# Altium schematic sheet Voltage Regulators.SchDoc: Voltage Regulators
size A4; Date: Dec. 27th, 2022; Author: Karl Asseily; DrawnBy: Karl Asseily; DocumentNumber: 202301140903; Revision: 1.2; SheetNumber: 8; SheetTotal: 20
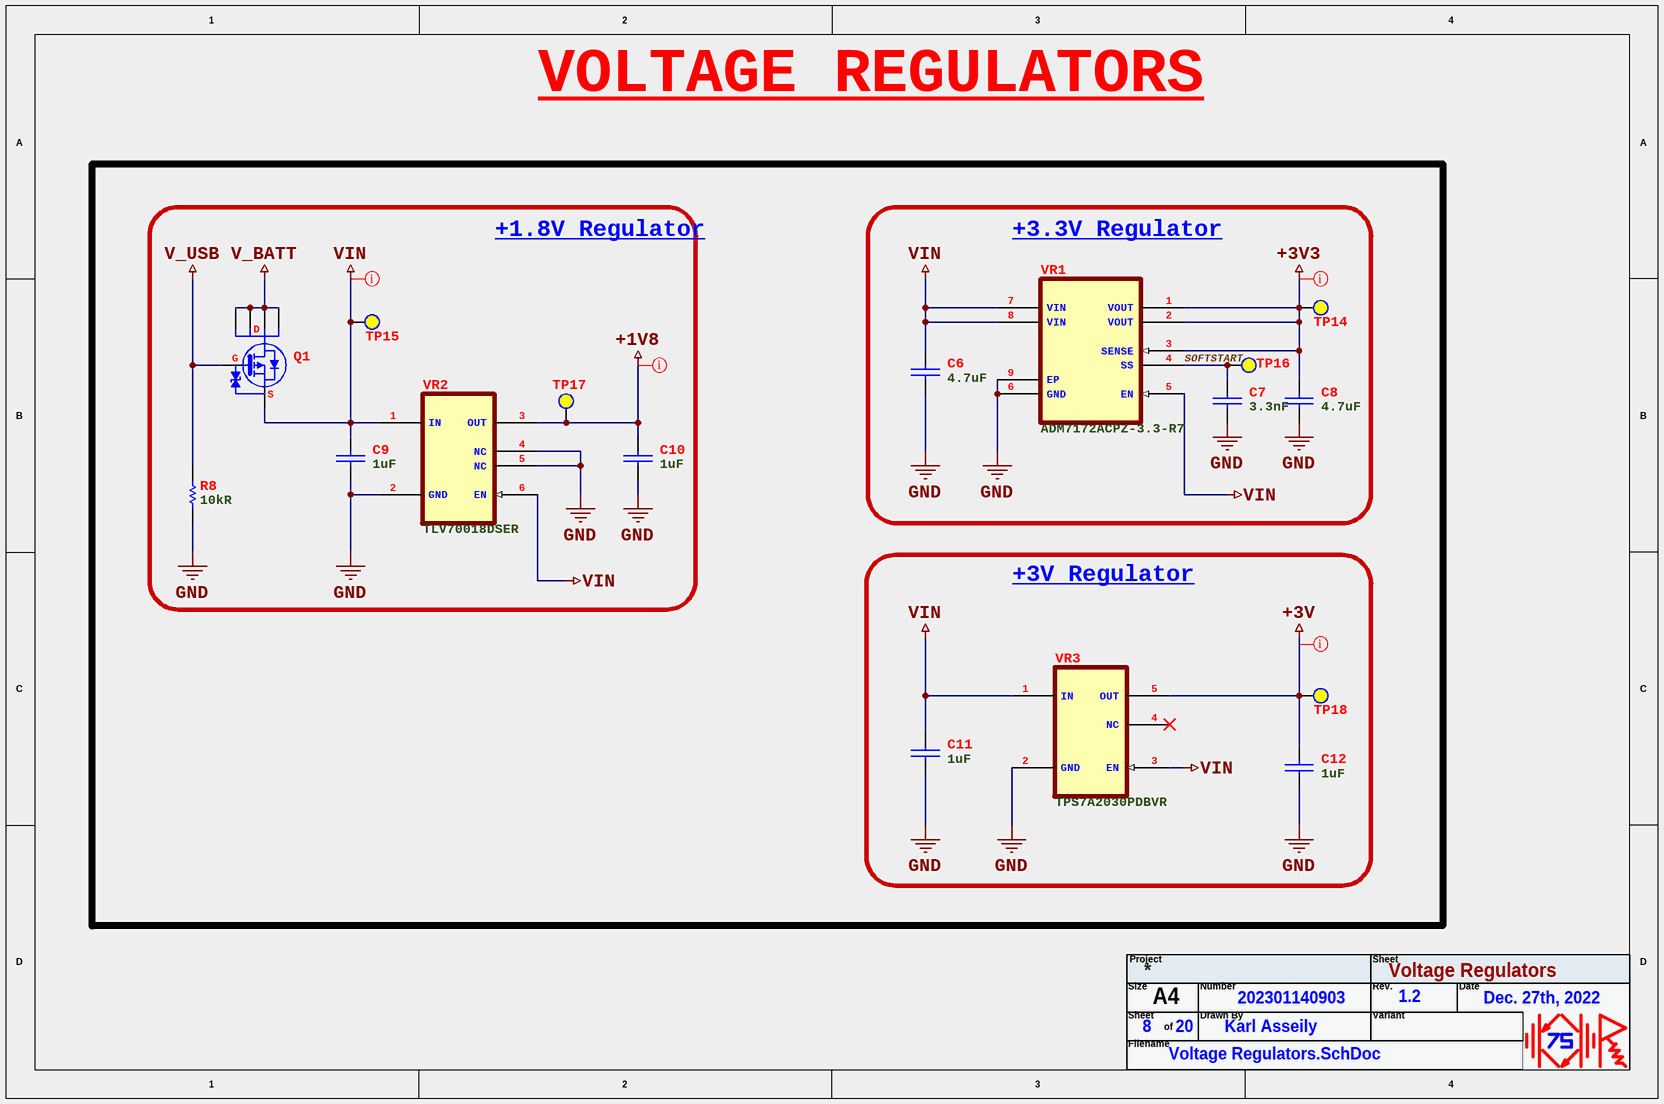
[diagram p0: Voltage Regulators.SchDoc]

## Parts
C6  4.7uF  [CAP_0805]
C7  3.3nF  [CAP_0603]
C8  4.7uF  [CAP_0805]
C9  1uF  [CAP_0805]
C10  1uF  [CAP_0805]
C11  1uF  [CAP_0805]
C12  1uF  [CAP_0805]
Q1  SSM6J412TU,LF  [MOS_SOTFL65P210X75-6N]  (value not drawn)
R8  10kR  [RES_0603]
TP14  +3V3  [TEST POINT PAD]  (value not drawn)  (no BOM)
TP15  VIN  [TEST POINT PAD]  (value not drawn)  (no BOM)
TP16  SOFTSTART  [TEST POINT HOLE]  (value not drawn)  (no BOM)
TP17  +1V8  [TEST POINT PAD]  (value not drawn)  (no BOM)
TP18  +3V  [TEST POINT PAD]  (value not drawn)  (no BOM)
VR1  ADM7172ACPZ-3.3-R7  [REG_SON50P300X300X80-9N]
VR2  TLV70018DSER  [REG_SON50P150X150X80-6N]
VR3  TPS7A2030PDBVR  [REG_SOT95P280X145-5N]

## Blocks framed on the sheet
+1.8V Regulator: C9 C10 Q1 R8 TP15 TP17 VR2
+3.3V Regulator: C6-C8 TP14 TP16 VR1
+3V Regulator: C11 C12 TP18 VR3

## Nets
+1V8: C10.1 TP17.TP VR2.3(OUT)
+3V: C12.1 TP18.TP VR3.5(OUT)
+3V3: C8.1 TP14.TP VR1.1(VOUT) VR1.2(VOUT) VR1.3(SENSE)
GND: C6.2 C7.2 C8.2 C9.2 C10.2 C11.2 C12.2 R8.2 VR1.6(GND) VR1.9(EP) VR2.2(GND) VR2.4(NC) VR2.5(NC) VR3.2(GND)
V_BATT: Q1.1(D) Q1.2(D) Q1.5(D) Q1.6(D)
V_USB: Q1.3(G) R8.1
VIN: C6.1 C9.1 C11.1 Q1.4(S) TP15.TP VR1.5(EN) VR1.7(VIN) VR1.8(VIN) VR2.1(IN) VR2.6(EN) VR3.1(IN) VR3.3(EN)
SOFTSTART: C7.1 TP16.TP VR1.4(SS)

Not connected (* = marked no-connect by the designer): VR3 4(NC)*

## Layout directives
net class POWER; rule Supply Nets [Voltage = 5.000]: VIN
net class POWER; rule Supply Nets [Voltage = 3.300]: +3V3
net class POWER; rule Supply Nets [Voltage = 1.800]: +1V8
net class POWER; rule Supply Nets [Voltage = 3.000]: +3V

## Notes on the sheet
- VOLTAGE REGULATORS
- (near Q1) D
- (near Q1) G
- (near Q1) S
- Project
- Sheet
- Size
- Filename
- A4
- of
- Number
- Drawn By
- Rev.
- Variant
- Date

## Library data of the parts
C6 C8 = CAP_4.7uF-25V-10%_0805: 4.7 µF ±10% 25V Ceramic Capacitor X7R 0805 (2012 Metric); Manufacturer: Yageo; Manufacturer Part Number: CC0805KKX7R8BB475; Supplier 1: Digi-Key; RoHS: Yes; Category: Ceramic Capacitors; Stock 1: 26099; Pricing 1: 1=0.39000, 10=0.27000, 50=0.18940, 100=0.16230, 500=0.12172, 1000=0.10278 (USD); Mounting Technology: Surface Mount; Case/Package: 0805; Case Code (Metric): 2012; Case Code (Imperial): 0805; Weight: 0.000194oz; Min Operating Temperature: -55°C; Max Operating Temperature: 125°C; Packaging: Tape and Reel; Capacitance: 4.7uF; Voltage Rating: 25V; Tolerance: 10%; Dielectric: X7R; Termination: SMD/SMT; Voltage Rating (DC): 25V; Package Quantity: 3000; Length: 0.079inch; Width: 0.049inch; Thickness: 0.057inch; Lead Free: Lead Free; Halogen Free: Halogen Free; RoHS Compliant: Yes; ComponentLink1URL: C:\Users\Public\Documents\Altium\Projects\Cellar_Watchdog\Docs\Capacitor\UPY-GP_NP0_16V-to-50V_18.pdf; ComponentLink1Description: Datasheet; Supplier 2: Mouser; Supplier Part Number 1: 311-1885-1-ND; Supplier Part Number 2: 603-CC805KKX7R8BB475
C7 = CAP_3.3nF-50V-10%_0603: 3300 pF ±10% 50V Ceramic Capacitor X7R 0603 (1608 Metric); Manufacturer: Yageo; Manufacturer Part Number: CC0603KRX7R9BB332; Dissipation Factor: 3%; Insulation Resistance: 100GR; Supplier 1: Digi-Key; RoHS: Yes; Category: Ceramic Capacitors; Stock 1: 541031; Pricing 1: 1=0.10000, 10=0.04600, 50=0.02480, 100=0.02030, 500=0.01450, 1000=0.01139 (USD); Mounting Technology: Surface Mount; Case/Package: 0603; Pins: 2; Case Code (Imperial): 0603; Case Code (Metric): 1608; Dielectric Material: Ceramic; Min Operating Temperature: -55°C; Max Operating Temperature: 125°C; Tolerance: 10%; Capacitance: 3.3nF; Dielectric: X7R; Package Quantity: 1; Voltage Rating: 50V; Voltage Rating (DC): 50V; Packaging: Tape and Reel; Termination: SMD/SMT; Resistor Type: Ceramic; Voltage: 50V; Series: CC; Length: 1.6mm; Width: 0.031inch; Height: 0.8mm; Thickness: 0.035inch; Depth: 0.8mm; Radiation Hardening: No; RoHS Compliant: Yes; Reach SVHC Compliant: Yes; Lead Free: Lead Free; Halogen Free: Halogen Free; ComponentLink1URL: C:\Users\Public\Documents\Altium\Projects\Cellar_Watchdog\Docs\Capacitor\UPY-GPHC_X7R_6.3V-to-250V_22.pdf; ComponentLink1Description: Datasheet; Supplier 2: Mouser; Supplier Part Number 1: 311-1082-1-ND; Supplier Part Number 2: 603-CC603KRX7R9BB332
C9-C12 = CAP_1uF-16V-10%_0603: 1 µF ±10% 16V Ceramic Capacitor X7R 0603 (1608 Metric); Manufacturer: Yageo; Manufacturer Part Number: CC0603KRX7R7BB105; Dissipation Factor: 5%; Supplier 1: Digi-Key; RoHS: Yes; Category: Ceramic Capacitors; Stock 1: 10491943; Pricing 1: 1=0.14000, 10=0.09800, 50=0.05560, 100=0.04610, 500=0.03234, 1000=0.02678 (USD); Mounting Technology: Surface Mount; Case/Package: 0603; Pins: 2; Case Code (Metric): 1608; Case Code (Imperial): 0603; Min Operating Temperature: -55°C; Max Operating Temperature: 125°C; Capacitance: 1uF; Tolerance: 10%; Dielectric: X7R; Voltage Rating: 16V; Package Quantity: 1; Packaging: Tape and Reel; Voltage Rating (DC): 16V; Termination: SMD/SMT; Resistor Type: Ceramic; Voltage: 16V; Series: CC; Construction: Flat; Length: 1.6mm; Width: 0.031inch; Height: 0.8mm; Thickness: 0.035inch; Depth: 0.8mm; Radiation Hardening: No; Lead Free: Lead Free; Halogen Free: Halogen Free; RoHS Compliant: Yes; ComponentLink1URL: C:\Users\Public\Documents\Altium\Projects\Cellar_Watchdog\Docs\Capacitor\UPY-GPHC_X7R_6.3V-to-250V_22.pdf; ComponentLink1Description: Datasheet; Supplier 2: Mouser; Supplier Part Number 1: 311-1446-1-ND; Supplier Part Number 2: 603-CC603KRX7R7BB105
Q1 = MOS-P_20V-4A-42.7mR_6-UF: P-Channel 20 V 4A (Ta) 1W (Ta) Surface Mount UF6; Manufacturer: Toshiba; Supplier 1: Digi-Key; Manufacturer Part Number: SSM6J412TU,LF; RoHS: No; Category: Uncategorized; Stock 1: 8000; Pricing 1: 1=0.37000, 10=0.29600, 100=0.20160, 500=0.15120, 1000=0.11340 (USD); Supplier 2: Mouser; Supplier Part Number 1: SSM6J412TULFCT-ND; Supplier Part Number 2: 757-SSM6J412TU,LF; ComponentLink1Description: Datasheet; ComponentLink1URL: C:\Users\Public\Documents\Altium\Projects\Cellar_Watchdog\Docs\MOSFET\SSM6J412TU_datasheet_en_20140301.pdf
R8 = RES_10kR-100mW-1%_0603: 10 kOhms ±1% 0.1W, 1/10W Chip Resistor 0603 (1608 Metric) Moisture Resistant Thick Film; Manufacturer: Yageo; Manufacturer Part Number: RC0603FR-0710KL; Temperature Coefficient: 100ppm/°C; Voltage Rating (DC): 50V; Power Rating: 100mW; Voltage Rating: 75V; Supplier 1: Digi-Key; RoHS: Yes; Category: Chip SMD Resistors; Stock 1: 43209622; Pricing 1: 1=0.10000, 10=0.02100, 100=0.00850, 1000=0.00383, 2500=0.00332 (USD); Case/Package: 0603; Pins: 2; Case Code (Imperial): 0603; Case Code (Metric): 1608; Weight: 7.1E-05oz; Min Operating Temperature: -55°C; Max Operating Temperature: 155°C; Tolerance: 1%; Resistor Type: Thick Film; Resistance: 10kR; Packaging: Tape and Reel; Termination: SMD/SMT; Features: Moisture Resistant; Series: RC; Max Power Dissipation: 100mW; Number of Terminations: 2; Resistance Tolerance: 1%; Construction: Rectangular; Length: 1.6mm; Width: 0.8mm; Height: 0.45mm; Depth: 0.8mm; Lead Pitch: 0.3mm; Reach SVHC Compliant: Yes; Lead Free: Lead Free; Military Standard: Not; RoHS Compliant: Yes; ComponentLink6URL: C:\Users\Public\Documents\Altium\Projects\Cellar_Watchdog\Docs\Resistor\PYu-RC_Group_51_RoHS_L_12.pdf; ComponentLink6Description: Datasheet; Supplier 2: Mouser; Supplier Part Number 1: 311-10.0KHRCT-ND; Supplier Part Number 2: 603-RC0603FR-0710KL
TP14-TP18 = Test Point: PCB Test Point; ClassName: Test Point
  TP14: Value: +3V3
  TP15: Value: VIN
  TP16: Value: SOFTSTART
  TP17: Value: +1V8
  TP18: Value: +3V
VR1 = REG_3.3V-2A_8-LFCSP-WD: Linear Voltage Regulator IC Positive Fixed 1 Output 2A 8-LFCSP-WD (3x3); Manufacturer: Analog Devices; Output Voltage: 3.3V; Dropout Voltage: 172mV; Number of Regulators: 1; Min Current Limit: 2.4A; Quiescent Current: 700uA; Max Input Voltage: 6.5V; Min Input Voltage: 2.3V; Supplier 1: Digi-Key; Manufacturer Part Number: ADM7172ACPZ-3.3-R7; RoHS: Yes; Category: Voltage Regulators - Linear; Stock 1: 4322; Pricing 1: 1=6.80000, 10=6.10500, 25=5.77160, 100=5.00210, 250=4.74560, 500=4.25824 (USD); Mount: Surface Mount; Number of Pins: 8; Min Operating Temperature: -40°C; Max Operating Temperature: 125°C; Packaging: Tape and Reel; Output Current: 2A; Package Quantity: 1500; Polarity: Positive; Max Output Current: 2A; Number of Outputs: 1; Output Type: Fixed; Lead Free: Contains Lead; RoHS Compliant: Yes; ComponentLink2URL: C:\Users\Public\Documents\Altium\Projects\Cellar_Watchdog\Docs\Voltage Regulator\ADM7172.pdf; ComponentLink2Description: Datasheet; Supplier 2: Mouser; Supplier Part Number 1: 505-ADM7172ACPZ-3.3-R7CT-ND; Supplier Part Number 2: 584-ADM7172ACPZ3.3R7
VR2 = REG_1.8V-200mA_6-WSON: Linear Voltage Regulator IC Positive Fixed 1 Output 200mA 6-WSON (1.5x1.5); Manufacturer: Texas Instruments; Output Voltage: 1.8V; Dropout Voltage: 175mV; Number of Outputs: 1; Max Power Dissipation: 555mW; Max Input Voltage: 5.5V; Min Input Voltage: 2V; Min Current Limit: 220mA; Output Voltage Accuracy: 2%; Quiescent Current: 30uA; Supplier 1: Digi-Key; Manufacturer Part Number: TLV70018DSER; RoHS: Yes; Category: Voltage Regulators - Linear; Stock 1: 24574; Pricing 1: 1=0.55000, 10=0.46900, 25=0.43760, 100=0.35020, 250=0.32520, 500=0.27518, 1000=0.21264 (USD); Case/Package: WFDFN; Number of Pins: 6; Min Operating Temperature: -40°C; Max Operating Temperature: 125°C; Packaging: Tape and Reel; Output Current: 200mA; Package Quantity: 3000; Max Output Current: 200mA; Number of Regulators: 1; Polarity: Positive; Power Dissipation: 555mW; Accuracy: 2%; Max Output Voltage: 1.8V; Min Output Voltage: 1.8V; Output Type: Fixed; Series: -; Lead Free: Lead Free; RoHS Compliant: Yes; ComponentLink2URL: C:\Users\Public\Documents\Altium\Projects\Cellar_Watchdog\Docs\Voltage Regulator\tlv700.pdf; ComponentLink2Description: Datasheet; Supplier 2: Mouser; Supplier Part Number 1: 296-39277-1-ND; Supplier Part Number 2: 595-TLV70018DSER
VR3 = REG_3V-300mA_SOT-23-5: Linear Voltage Regulator IC Positive Fixed 1 Output 300mA SOT-23-5; Manufacturer: Texas Instruments; Supplier 1: Digi-Key; Manufacturer Part Number: TPS7A2030PDBVR; RoHS: Yes; Category: Voltage Regulators - Linear; Stock 1: 34133; Pricing 1: 1=0.49000, 10=0.41700, 25=0.38960, 100=0.31160, 250=0.28936, 500=0.24486, 1000=0.18921 (USD); RoHS Compliant: Yes; Supplier 2: Mouser; ComponentLink1Description: Datasheet; ComponentLink1URL: C:\Users\Public\Documents\Altium\Projects\Cellar_Watchdog\Docs\Voltage Regulator\tps7a20.pdf; Supplier Part Number 1: 296-TPS7A2030PDBVRCT-ND; Supplier Part Number 2: 595-TPS7A2030PDBVR